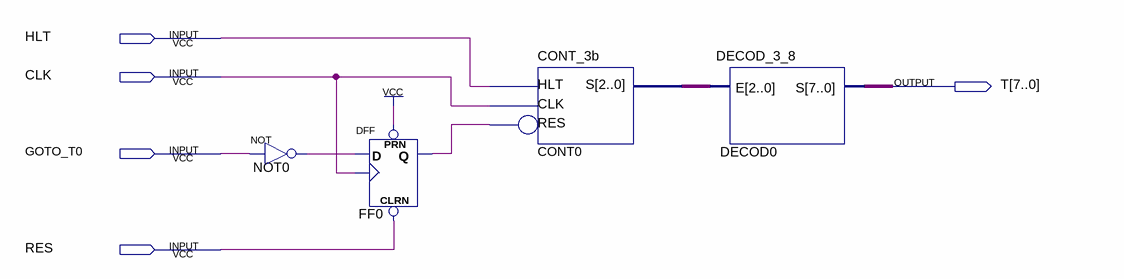
[diagram p0: schematic sheet]
// Quartus schematic TEMPORIZADOR.bdf as structural Verilog: 4 symbols, 5 pins
module TEMPORIZADOR (
  input  HLT,
  input  CLK,
  input  GOTO_T0,
  input  RES,
  output [7:0] T
);

  wire FF0_q, NOT0_out;
  wire [2:0] CONT0_s;

  not NOT0 (NOT0_out, GOTO_T0);
  DFF FF0 (.CLRN(RES), .CLK(CLK), .D(NOT0_out), .PRN(1'b1), .Q(FF0_q));
  CONT_3b CONT0 (.HLT(HLT), .CLK(CLK), .RES(FF0_q), .S(CONT0_s));
  DECOD_3_8 DECOD0 (.E(CONT0_s), .S(T));
endmodule
